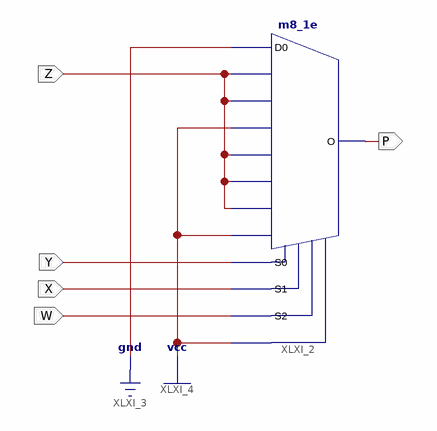
[diagram p0: schematic sheet 1]
// Xilinx ISE schematic Votecircuit2.sch (spartan3) as structural Verilog: 1 symbols, 5 ports
module Votecircuit2 (
  input  Z,
  input  Y,
  input  X,
  input  W,
  output P
);

  m8_1e XLXI_2 (
    .D0(1'b0), .D1(Z), .D2(Z), .D3(1'b1), .D4(Z), .D5(Z), .D6(Z), .D7(1'b1), .E(1'b1), .S0(Y), .S1(X),
    .S2(W), .O(P));
endmodule
